# EAGLE design Control Panel (EAGLE 9.4.2)
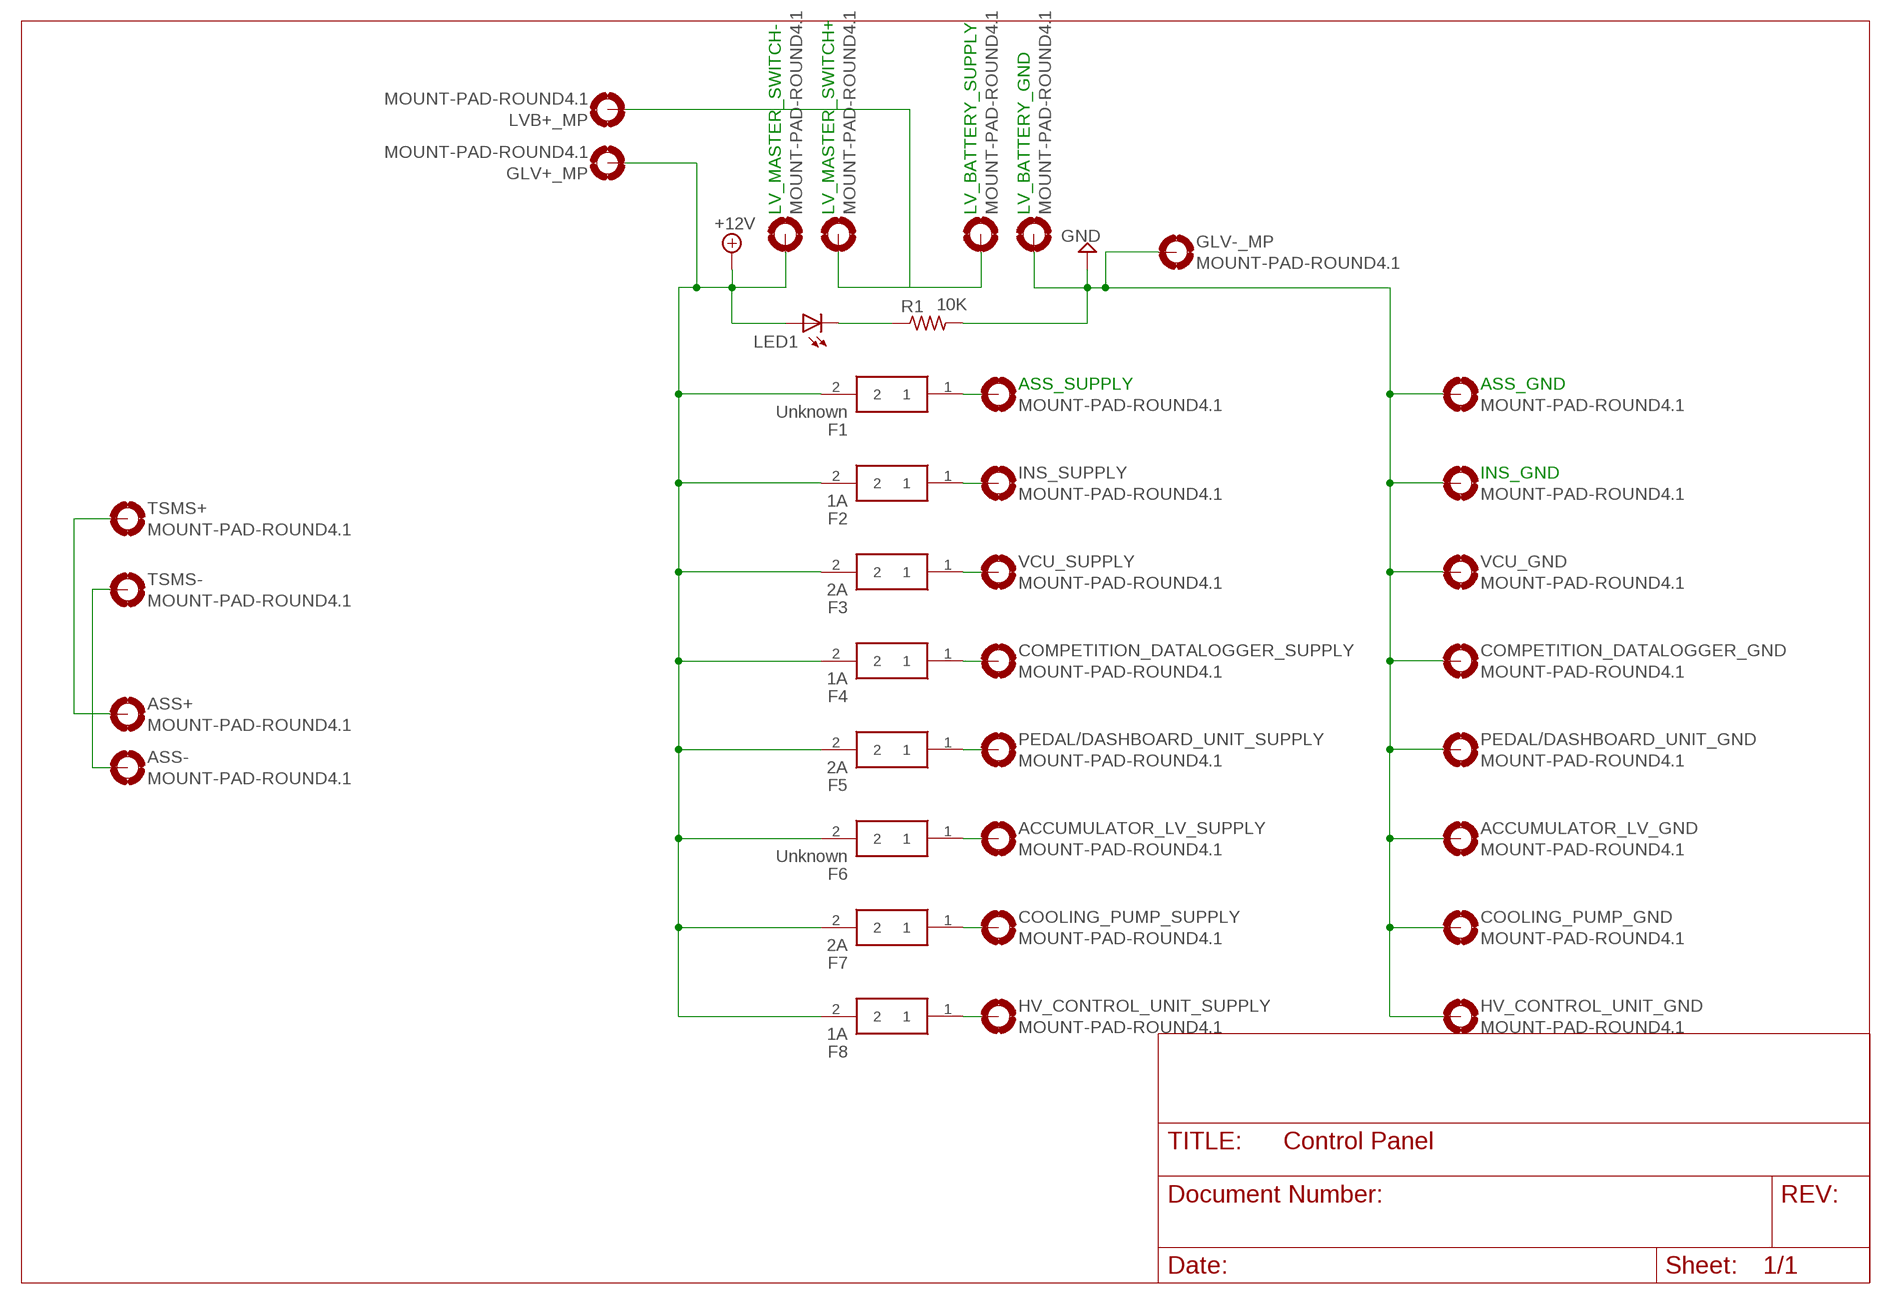
[diagram p0: schematic, sheet 1]

## Parts
ACCUMULATOR_LV_GND  MOUNT-PAD-ROUND4.1  [4,1-PAD]
ACCUMULATOR_LV_SUPPLY  MOUNT-PAD-ROUND4.1  [4,1-PAD]
ASS+  MOUNT-PAD-ROUND4.1  [4,1-PAD]
ASS-  MOUNT-PAD-ROUND4.1  [4,1-PAD]
ASS_GND  MOUNT-PAD-ROUND4.1  [4,1-PAD]
ASS_SUPPLY  MOUNT-PAD-ROUND4.1  [4,1-PAD]
COMPETITION_DATALOGGER_GND  MOUNT-PAD-ROUND4.1  [4,1-PAD]
COMPETITION_DATALOGGER_SUPPLY  MOUNT-PAD-ROUND4.1  [4,1-PAD]
COOLING_PUMP_GND  MOUNT-PAD-ROUND4.1  [4,1-PAD]
COOLING_PUMP_SUPPLY  MOUNT-PAD-ROUND4.1  [4,1-PAD]
F1  Unknown  01530008Z  [01530008]
F2  1A  01530008Z  [01530008]
F3  2A  01530008Z  [01530008]
F4  1A  01530008Z  [01530008]
F5  2A  01530008Z  [01530008]
F6  Unknown  01530008Z  [01530008]
F7  2A  01530008Z  [01530008]
F8  1A  01530008Z  [01530008]
GLV+_MP  MOUNT-PAD-ROUND4.1  [4,1-PAD]
GLV-_MP  MOUNT-PAD-ROUND4.1  [4,1-PAD]
HV_CONTROL_UNIT_GND  MOUNT-PAD-ROUND4.1  [4,1-PAD]
HV_CONTROL_UNIT_SUPPLY  MOUNT-PAD-ROUND4.1  [4,1-PAD]
INS_GND  MOUNT-PAD-ROUND4.1  [4,1-PAD]
INS_SUPPLY  MOUNT-PAD-ROUND4.1  [4,1-PAD]
LED1  LED3MM  [LED3MM]
LV_BATTERY_GND  MOUNT-PAD-ROUND4.1  [4,1-PAD]
LV_BATTERY_SUPPLY  MOUNT-PAD-ROUND4.1  [4,1-PAD]
LV_MASTER_SWITCH+  MOUNT-PAD-ROUND4.1  [4,1-PAD]
LV_MASTER_SWITCH-  MOUNT-PAD-ROUND4.1  [4,1-PAD]
LVB+_MP  MOUNT-PAD-ROUND4.1  [4,1-PAD]
PEDAL/DASHBOARD_UNIT_GND  MOUNT-PAD-ROUND4.1  [4,1-PAD]
PEDAL/DASHBOARD_UNIT_SUPPLY  MOUNT-PAD-ROUND4.1  [4,1-PAD]
R1  10K  R-US_0207/12  [0207/12]
TSMS+  MOUNT-PAD-ROUND4.1  [4,1-PAD]
TSMS-  MOUNT-PAD-ROUND4.1  [4,1-PAD]
VCU_GND  MOUNT-PAD-ROUND4.1  [4,1-PAD]
VCU_SUPPLY  MOUNT-PAD-ROUND4.1  [4,1-PAD]

## Nets
+12V: F1.2 F2.2 F3.2 F4.2 F5.2 F6.2 F7.2 F8.2 GLV+_MP.B4,1(MOUNT) LED1.A LV_MASTER_SWITCH-.B4,1(MOUNT)
GND1: ACCUMULATOR_LV_GND.B4,1(MOUNT) ASS_GND.B4,1(MOUNT) COMPETITION_DATALOGGER_GND.B4,1(MOUNT) COOLING_PUMP_GND.B4,1(MOUNT) GLV-_MP.B4,1(MOUNT) HV_CONTROL_UNIT_GND.B4,1(MOUNT) INS_GND.B4,1(MOUNT) LV_BATTERY_GND.B4,1(MOUNT) PEDAL/DASHBOARD_UNIT_GND.B4,1(MOUNT) R1.2 VCU_GND.B4,1(MOUNT) ; supply symbol labelled GND
N$1: F2.1 INS_SUPPLY.B4,1(MOUNT)
N$2: ASS_SUPPLY.B4,1(MOUNT) F1.1
N$3: F3.1 VCU_SUPPLY.B4,1(MOUNT)
N$4: COMPETITION_DATALOGGER_SUPPLY.B4,1(MOUNT) F4.1
N$5: LV_BATTERY_SUPPLY.B4,1(MOUNT) LV_MASTER_SWITCH+.B4,1(MOUNT) LVB+_MP.B4,1(MOUNT)
N$6: F5.1 PEDAL/DASHBOARD_UNIT_SUPPLY.B4,1(MOUNT)
N$8: ACCUMULATOR_LV_SUPPLY.B4,1(MOUNT) F6.1
N$9: COOLING_PUMP_SUPPLY.B4,1(MOUNT) F7.1
N$10: LED1.K(C) R1.1
N$11: ASS+.B4,1(MOUNT) TSMS+.B4,1(MOUNT)
N$12: ASS-.B4,1(MOUNT) TSMS-.B4,1(MOUNT)
N$13: F8.1 HV_CONTROL_UNIT_SUPPLY.B4,1(MOUNT)

## Library data of the parts
ACCUMULATOR_LV_GND ACCUMULATOR_LV_SUPPLY ASS+ ASS- ASS_GND ASS_SUPPLY COMPETITION_DATALOGGER_GND COMPETITION_DATALOGGER_SUPPLY COOLING_PUMP_GND COOLING_PUMP_SUPPLY GLV+_MP GLV-_MP HV_CONTROL_UNIT_GND HV_CONTROL_UNIT_SUPPLY INS_GND INS_SUPPLY LV_BATTERY_GND LV_BATTERY_SUPPLY LV_MASTER_SWITCH+ LV_MASTER_SWITCH- LVB+_MP PEDAL/DASHBOARD_UNIT_GND PEDAL/DASHBOARD_UNIT_SUPPLY TSMS+ TSMS- VCU_GND VCU_SUPPLY = holes:MOUNT-PAD-ROUND: MOUNTING PAD, round
F1-F8 = SamacSys_Parts:01530008Z: Mini fuseholder,15A 32V Littelfuse 15A PCB Mount Fuse Holder Automotive Fuse, 32 V Source: Datasheet <http://www.littelfuse.com/data/en/data_sheets/153_pcmount.pdf>; ALLIED_NUMBER: 70184304; DESCRIPTION: Mini fuseholder,15A 32V Littelfuse 15A PCB Mount Fuse Holder Automotive Fuse, 32 V; HEIGHT: mm; MANUFACTURER_NAME: LITTELFUSE; MANUFACTURER_PART_NUMBER: 01530008Z; RS_PART_NUMBER: 3607317; RS_PRICE-STOCK: https://uk.rs-online.com/web/p/products/3607317
LED1 = adafruit:LED: LED OSRAM: - CHIPLED LG R971, LG N971, LY N971, LG Q971, LY Q971, LO R971, LY R971 LH N974, LH R974 LS Q976, LO Q976, LY Q976 LO Q996 - Hyper CHIPLED LW Q18S LB Q993, LB Q99A, LB R99A - SideLED LS A670, LO A670, LY A670, LG A670, LP A670 LB A673, LV A673, LT A673, LW A673 LH A674 LY A675 LS A676, LA A676, LO A676, LY A676, LW A676 LS A679, LY A679, LG A679 - Hyper Micro SIDELED® LS Y876, LA Y876, LO Y876, LY Y876 LT Y87S - SmartLED LW L88C, LW L88S LB L89C, LB L89S, LG L890 LS L89K, LO L89K, LY L89K LS L896, LA L896, LO L896, LY L896 - TOPLED LS T670, LO T670, LY T670, LG T670, LP T670 LSG T670, LSP T670, LSY T670, LOP T670, LYG T670 LG T671, LOG T671, LSG T671 LB T673, LV T673, LT T673, LW T673 LH T674 LS T676, LA T676, LO T676, LY T676, LB T676, LH T676, LSB T676, LW T676 LB T67C, LV T67C, LT T67C, LS T67K, LO T67K, LY T67K, LW E67C LS E67B, LA E67B, LO E67B, LY E67B, LB E67C, LV E67C, LT E67C LW T67C LS T679, LY T679, LG T679 LS T770, LO T770, LY T770, LG T770, LP T770 LB T773, LV T773, LT T773, LW T773 LH T774 LS E675, LA E675, LY E675, LS T675 LS T776, LA T776, LO T776, LY T776, LB T776 LHGB T686 LT T68C, LB T68C - Hyper Mini TOPLED® LB M676 - Mini TOPLED Santana® LG M470 LS M47K, LO M47K, LY M47K Source: http://www.osram.convergy.de/
R1 = adafruit:R-US_: RESISTOR, American symbol

## Board
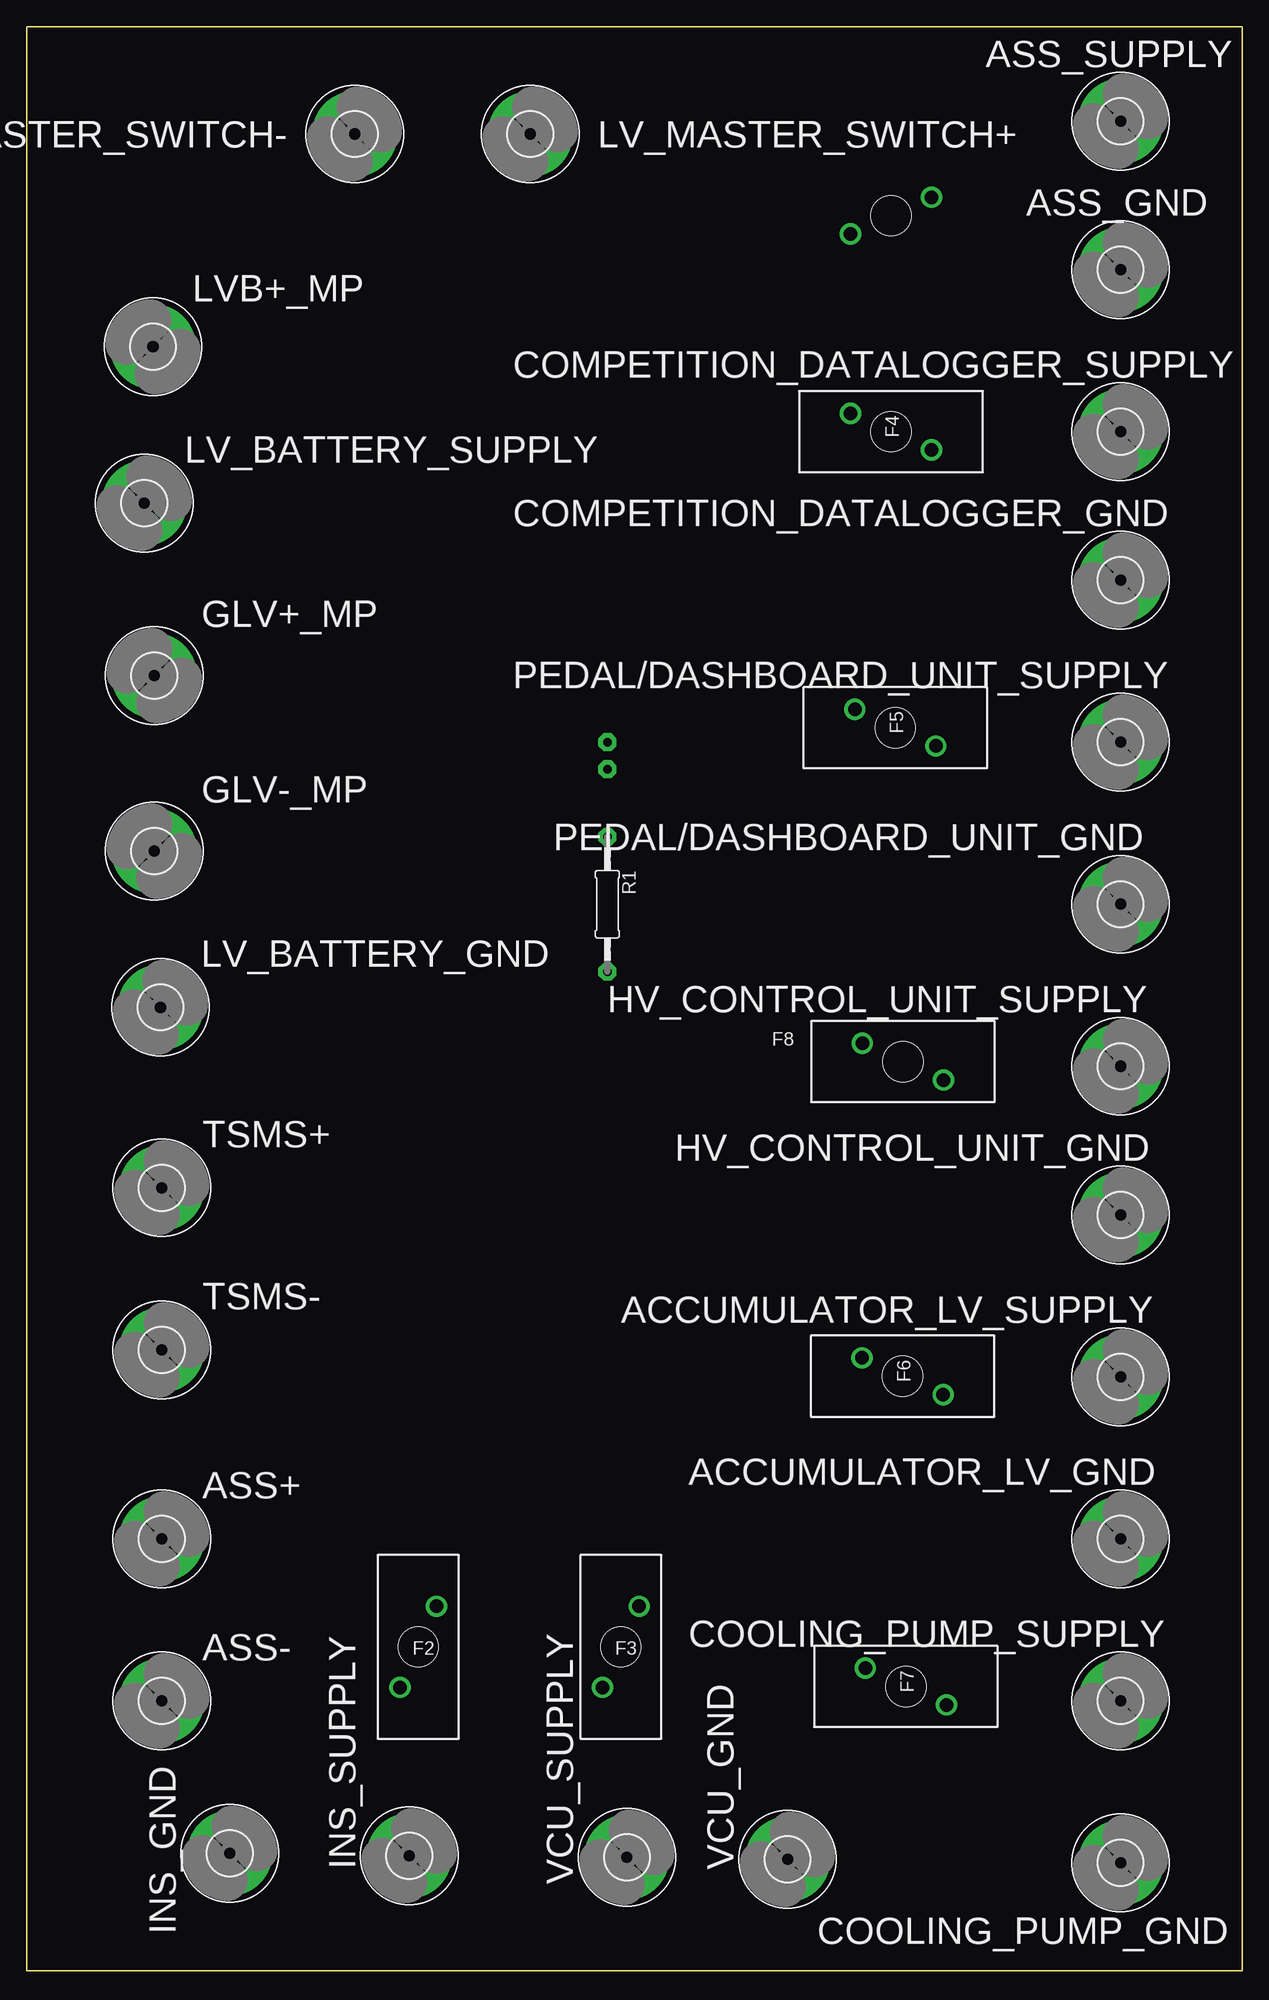
[diagram p1: board, top side]
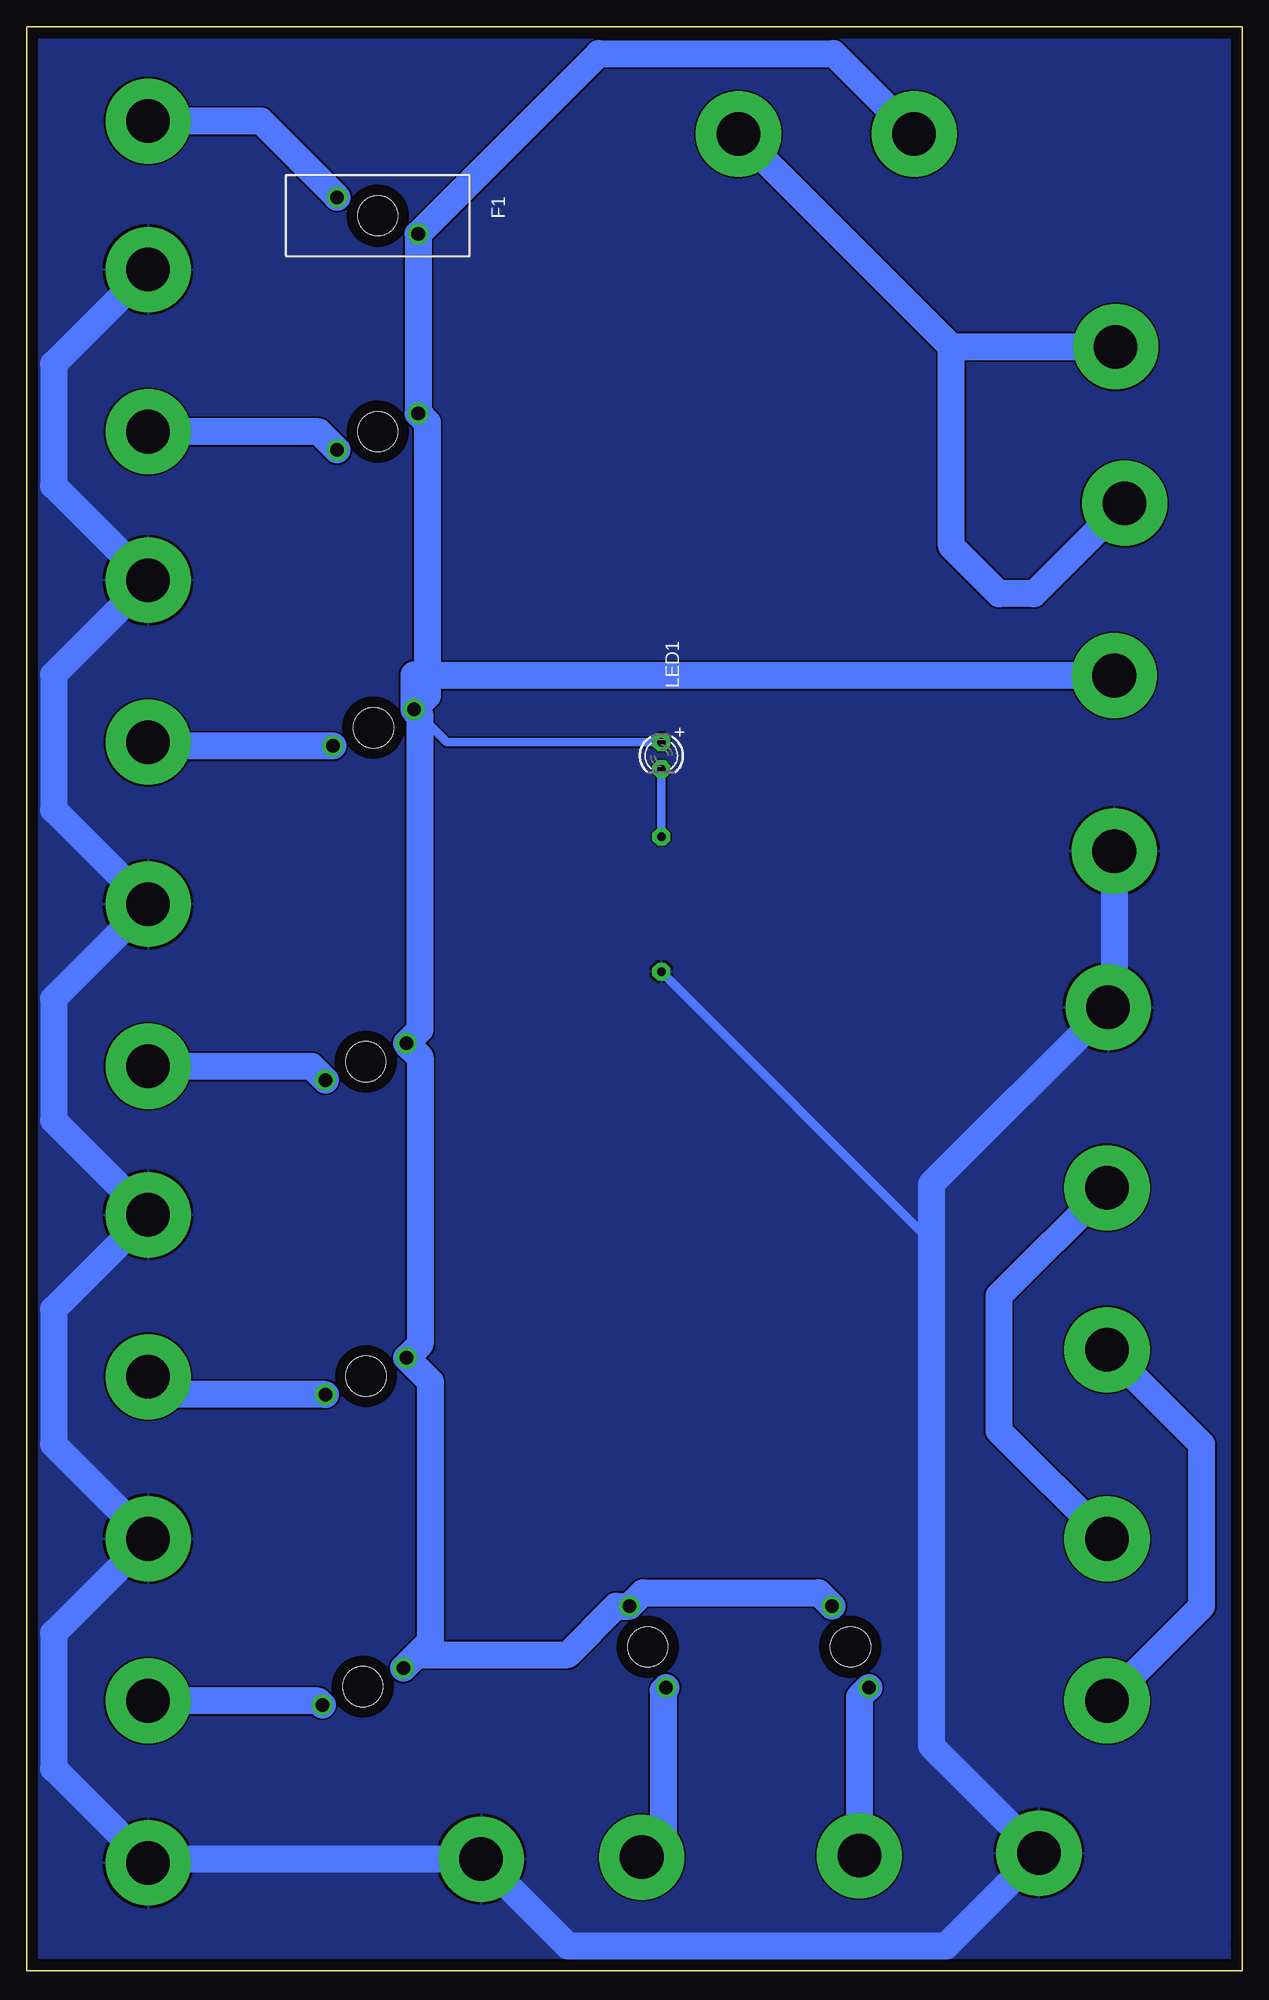
[diagram p2: board, bottom side, seen from below]

Size 114.3 x 182.88 mm. Coordinates in mm from the lower left corner, seen from the top.
Outline: 114.3,2.54 114.3,182.88 0,182.88 0,2.54 0,0 114.3,0 114.3,2.54
Copper layers (1*16): Top 0.035mm / dielectric 1.5mm / Bottom 0.035mm
Design rules "default": minimum track width 6mil, minimum drill 0.35mm, track to track 6mil, track to pad 6mil, pad to pad 6mil, via to via 6mil, smd to smd 6mil, copper to edge 40mil, drill to drill 6mil, minimum pad ring 10mil, minimum via ring 8mil, stop-mask expansion 4mil, vias tented up to drill 0mil, thermal gap 10mil

### Footprints (pad centres in the part's own frame; a part is rotated, then mirrored left to right if it is on the bottom)
4,1-PAD = drill 4.1 pad 8: B4,1 0,0
01530008 = drill 1.27 pad 2: 1 1.727,3.81; 2 -1.727,-3.81 | hole 3.785: 0,0
LED3MM = drill 0.813 pad 1.676 octagon: A -1.27,0; K 1.27,0
0207/12 = drill 0.813 pad 1.676 octagon: 1 -6.35,0; 2 6.35,0

### Placement (x,y rotation side)
ACCUMULATOR_LV_GND  102.87,40.64 0 top
ACCUMULATOR_LV_SUPPLY  102.87,55.88 0 top
ASS+  12.7,40.64 0 top
ASS-  12.7,25.4 0 top
ASS_GND  102.87,160.02 0 top
ASS_SUPPLY  102.87,173.99 0 top
COMPETITION_DATALOGGER_GND  102.87,130.81 0 top
COMPETITION_DATALOGGER_SUPPLY  102.87,144.78 0 top
COOLING_PUMP_GND  102.87,10.16 0 top
COOLING_PUMP_SUPPLY  102.87,25.4 0 top
F1  81.28,165.1 90 bottom
F2  36.83,30.48 180 top
F3  55.88,30.48 180 top
F4  81.28,144.78 270 top
F5  81.69,116.93 270 top
F6  82.38,55.94 270 top
F7  82.68,26.75 270 top
F8  82.4,85.52 270 top
GLV+_MP  12.02,121.84 90 top
GLV-_MP  12.02,105.33 90 top
HV_CONTROL_UNIT_GND  102.87,71.12 0 top
HV_CONTROL_UNIT_SUPPLY  102.87,85.09 0 top
INS_GND  19.1,11.08 0 top
INS_SUPPLY  36,10.84 0 top
LED1  54.61,114.3 270 bottom
LV_BATTERY_GND  12.59,90.64 0 top
LV_BATTERY_SUPPLY  11.05,138.05 0 top
LV_MASTER_SWITCH+  47.35,172.78 0 top
LV_MASTER_SWITCH-  30.84,172.78 180 top
LVB+_MP  11.89,152.76 90 top
PEDAL/DASHBOARD_UNIT_GND  102.87,100.33 0 top
PEDAL/DASHBOARD_UNIT_SUPPLY  102.87,115.57 0 top
R1  54.61,100.33 270 top
TSMS+  12.7,73.66 0 top
TSMS-  12.7,58.42 0 top
VCU_GND  71.56,10.5 0 top
VCU_SUPPLY  56.46,10.69 0 top

### Tracks (layer width: path | path; a pad name or v marks a point on that pad's centre or on a via)
+12V
  Bottom 0.813: F5.2 74.79,115.57 LED1.A
  Bottom 2.54: LV_MASTER_SWITCH-.B4,1 38.41,180.34 60.5,180.34 F1.2 F4.2 76.61,145.65 76.61,119.93 F5.2 | F5.2 77.88,121.92 77.8,121.84 GLV+_MP.B4,1 | F5.2 77.32,118.1 77.32,88.52 F8.2 77.3,85.96 77.3,58.94 F6.2 76.34,55.43 76.34,31.01 F7.2 77.6,29.74 63.42,29.74 58.88,34.29 F3.2 56.34,35.56 39.83,35.56 F2.2
GND1
  Bottom 0.813: R1.2 29.21,68.58
  Bottom 2.54: ASS_GND.B4,1 111.76,151.13 111.76,139.7 COMPETITION_DATALOGGER_GND.B4,1 111.76,121.92 111.76,109.22 PEDAL/DASHBOARD_UNIT_GND.B4,1 111.76,91.44 111.76,80.01 HV_CONTROL_UNIT_GND.B4,1 111.76,62.23 111.76,49.53 ACCUMULATOR_LV_GND.B4,1 111.76,31.75 111.76,19.05 COOLING_PUMP_GND.B4,1 102.53,10.51 VCU_GND.B4,1 63.4,2.35 27.82,2.35 INS_GND.B4,1 29.21,21.19 29.21,68.58 29.21,74.02 LV_BATTERY_GND.B4,1 12.02,91.21 GLV-_MP.B4,1
  pour Bottom: 0,0 114.3,0 114.3,182.88 0,182.88
N$1
  Bottom 2.54: F2.1 35.99,25.78 INS_SUPPLY.B4,1
N$2
  Bottom 2.54: F1.1 92.25,173.99 ASS_SUPPLY.B4,1
N$3
  Bottom 2.54: F3.1 54.43,26.39 54.43,12.72 VCU_SUPPLY.B4,1
N$4
  Bottom 2.54: F4.1 86.82,144.78 COMPETITION_DATALOGGER_SUPPLY.B4,1
N$5
  Bottom 2.54: LV_MASTER_SWITCH+.B4,1 27.34,152.76 | 27.34,152.76 LVB+_MP.B4,1 | LV_BATTERY_SUPPLY.B4,1 19.56,129.54 22.86,129.54 27.34,134.01 27.34,152.76
N$6
  Bottom 2.54: F5.1 102.51,115.21 PEDAL/DASHBOARD_UNIT_SUPPLY.B4,1
N$8
  Bottom 2.54: F6.1 101.2,54.21 ACCUMULATOR_LV_SUPPLY.B4,1
N$9
  Bottom 2.54: F7.1 86.88,25.4 COOLING_PUMP_SUPPLY.B4,1
N$10
  Bottom 0.813: LED1.K R1.1
N$11
  Bottom 2.54: TSMS+.B4,1 22.86,63.5 22.86,50.8 ASS+.B4,1
N$12
  Bottom 2.54: ASS-.B4,1 3.81,34.29 3.81,49.53 TSMS-.B4,1
N$13
  Bottom 2.54: F8.1 87.51,85.09 HV_CONTROL_UNIT_SUPPLY.B4,1